# Altium schematic sheet VoltageRegulator3.3.schdoc
size A4; SheetNumber: 1; SheetTotal: 1
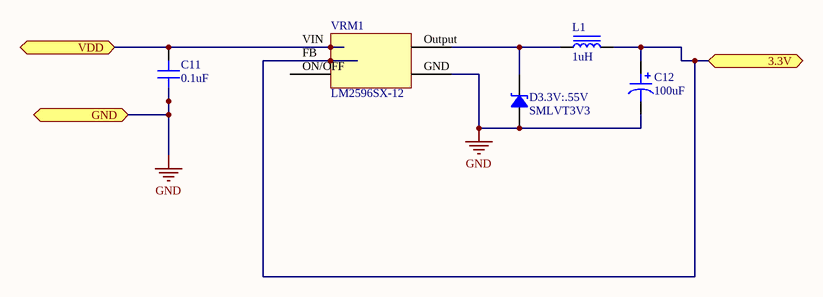
[diagram p0: VoltageRegulator3.3.schdoc]

## Parts
C11  0.1uF  [CAP 0402/1005]
C12  100uF  [CAP ALUM 6.6MM]
D3.3V:.55V  SMLVT3V3  [ST DO214AA SMB]
L1  1uH  [TDK VLS252010CX]
VRM1  LM2596SX-12  [DPAK170P1418X200-6L]

## Ports
3.3V, GND, VDD

## Nets
GND: C11.1 C12.2 D3.3V:.55V.1 VRM1.GND ; port GND
3.3V: C12.1 L1.2 VRM1.FB ; port 3.3V
VDD: C11.2 VRM1.VIN(Vin) ; port VDD
NetD3.3V:.55V_2: D3.3V:.55V.2 L1.1 VRM1.Output

Not connected (* = marked no-connect by the designer): VRM1 ON/OFF(*)

## Notes on the sheet
- Title
- Size:
- Date:
- A4
- Number:
- Time:
- Revision:
- Sheet
- of
- File:

## Library data of the parts
C11 = C1005X7R1C104K050BC: CAP CER 0.1UF 16V X7R 0402; Manufacturer: TDK Corporation; TemperatureRange: -55C ~ 125C; Tolerance: 10%; Value: 0.1uF; Part Number: C1005X7R1C104K050BC; PartId: 3856; Supplier 1: Digi-Key; Supplier Part Number 1: 445-4952-2-ND; ComponentLink1Description: Datasheet; ComponentLink1URL: https://product.tdk.com/info/en/catalog/datasheets/mlcc_commercial_general_en.pdf; ComponentLink2Description: Digi-Key listing; ComponentLink2URL: http://digikey.com/product-detail/en/C1005X7R1C104K050BC/445-4952-2-ND/2093220; TemperatureCoefficient: X7R; Voltage: 16V; Price: 0.0066; Type: -; Device Package: 0402 (1005 Metric)
C12 = 16SVPC100M: CAP POLYMER 100UF 20% 16V SMD; Manufacturer: Panasonic Electronic Components; TemperatureRange: -55C ~ 105C; Ripple Current: 2.49A; Lifetime @ Temp: 2000 Hrs @ 105C; Value: 100uF; Part Number: 16SVPC100M; PartId: 7484; Supplier 1: Digi-Key; Supplier Part Number 1: P16468TR-ND; ComponentLink1Description: Datasheet; ComponentLink1URL: http://industrial.panasonic.com/www-cgi/jvcr13pz.cgi?E+CI+4+AAB8004+16SVPC100M+8+WW; ComponentLink2Description: Digi-Key listing; ComponentLink2URL: http://digikey.com/product-detail/en/16SVPC100M/P16468TR-ND/4204800; Tolerance: 20%; Voltage: 16V; Price: 0.4169; Type: -; Device Package: Radial, Can - SMD; Impedance: -
D3.3V:.55V = SMLVT3V3: TVS DIODE 3.3VWM 10.3VC SMB; Manufacturer: STMicroelectronics; Type: Zener; Unidirectional Channels: 1; Power - Peak Pulse: 600W; Current - Peak Pulse: 200A (8/20us); Voltage (Clamping): 10.3V; Voltage (Breakdown): 4.1V; Voltage (Reverse Standoff): 3.3V; Capacitance @ Frequency: 5200pF @ 1MHz; Part Number: SMLVT3V3; PartId: 14618; Supplier 1: Digi-Key; Supplier Part Number 1: 497-2496-2-ND; ComponentLink1Description: Datasheet; ComponentLink1URL: http://www.st.com/web/en/resource/technical/document/datasheet/CD00000923.pdf; ComponentLink2Description: Digi-Key Listing; ComponentLink2URL: https://www.digikey.com/product-detail/en/stmicroelectronics/SMLVT3V3/497-2496-2-ND/603521; Operating Temperature: -25C ~ 175C (TJ); Price: 0.2247; Device Package: DO-214AA, SMB
L1 = VLS252010CX-1R0M: FIXED IND 1UH 2.29A 65 MOHM SMD; Manufacturer: TDK Corporation; Type: Wirewound; Tolerance: 20%; Shielding: Shielded; DC Resistance (DCR): 65 mOhm Max; Value: 1uH; Part Number: VLS252010CX-1R0M; PartId: 9466; Supplier 1: Digi-Key; Supplier Part Number 1: 445-172969-2-ND; ComponentLink1Description: Datasheet; ComponentLink1URL: https://product.tdk.com/info/en/catalog/datasheets/inductor_commercial_power_vls252010cx_en.pdf; ComponentLink2Description: Digi-Key Listing; ComponentLink2URL: https://www.digikey.com/product-detail/en/VLS252010CX-1R0M/445-172969-2-ND/5169774; Price: 0.1785; Device Package: Nonstandard; Series: VLS-CX; Inductance: 1uH; Current Rating: 2.29A; Q @ Freq: -; Frequency - Self Resonant: -; Operating Temperature: -40C ~ 105C